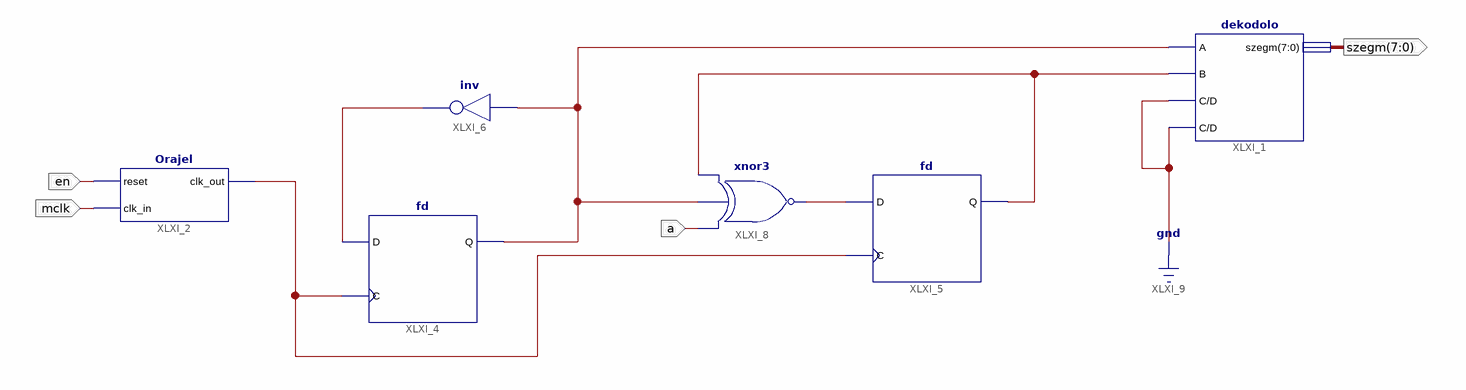
[diagram p0: schematic sheet 1]
// Xilinx ISE schematic bitelore.sch (spartan3e) as structural Verilog: 6 symbols, 4 ports
module bitelore (
  input  en,
  input  mclk,
  input  a,
  output [7:0] szegm
);

  wire XLXN_1, XLXN_3, XLXN_4, XLXN_5, XLXN_6;

  dekodolo XLXI_1 (.A(XLXN_4), .B(XLXN_5), .C(1'b0), .D(1'b0), .szegm(szegm));
  Orajel XLXI_2 (.reset(en), .clk_in(mclk), .clk_out(XLXN_3));
  fd XLXI_4 (.C(XLXN_3), .D(XLXN_6), .Q(XLXN_4));
  fd XLXI_5 (.C(XLXN_3), .D(XLXN_1), .Q(XLXN_5));
  not XLXI_6 (XLXN_6, XLXN_4);
  xnor XLXI_8 (XLXN_1, a, XLXN_4, XLXN_5);
endmodule
